# Altium schematic sheet UIO_INT.SchDoc: LiveDesign Evaluation - EvalBoard Tester
size A4; Organization: Altium Limited; Address1: L3, 12a Rodborough Rd; Address2: Frenchs Forest; Address3: NSW; Address4: Australia 2086; DocumentNumber: 8; SheetNumber: 8; SheetTotal: 16
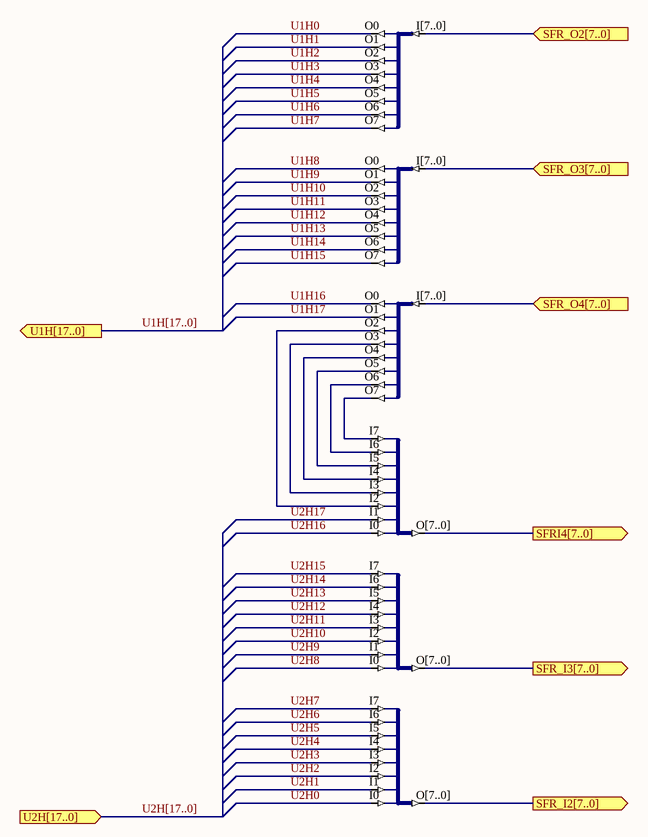
[diagram p0: UIO_INT.SchDoc]

## Parts
U198  J8B_8S  (value not drawn)
U199  J8B_8S  (value not drawn)
U200  J8B_8S  (value not drawn)
U201  J8S_8B  (value not drawn)
U202  J8S_8B  (value not drawn)
U203  J8S_8B  (value not drawn)

## Ports
SFR_I2[7..0] (out), SFR_I3[7..0] (out), SFR_O2[7..0] (in), SFR_O3[7..0] (in), SFR_O4[7..0] (in), SFRI4[7..0] (out), U1H[17..0] (out), U2H[17..0] (in)

## Nets
SFR_I2[7..0]: U203.O[7..0] ; port SFR_I2[7..0]
SFR_I3[7..0]: U202.O[7..0] ; port SFR_I3[7..0]
SFR_O2[7..0]: U198.I[7..0] ; port SFR_O2[7..0]
SFR_O3[7..0]: U199.I[7..0] ; port SFR_O3[7..0]
SFR_O4[7..0]: U200.I[7..0] ; port SFR_O4[7..0]
SFRI4[7..0]: U201.O[7..0] ; port SFRI4[7..0]
U1H0: U198.O0
U1H1: U198.O1
U1H2: U198.O2
U1H3: U198.O3
U1H4: U198.O4
U1H5: U198.O5
U1H6: U198.O6
U1H7: U198.O7
U1H8: U199.O0
U1H9: U199.O1
U1H10: U199.O2
U1H11: U199.O3
U1H12: U199.O4
U1H13: U199.O5
U1H14: U199.O6
U1H15: U199.O7
U1H16: U200.O0
U1H17: U200.O1
U2H0: U203.I0
U2H1: U203.I1
U2H2: U203.I2
U2H3: U203.I3
U2H4: U203.I4
U2H5: U203.I5
U2H6: U203.I6
U2H7: U203.I7
U2H8: U202.I0
U2H9: U202.I1
U2H10: U202.I2
U2H11: U202.I3
U2H12: U202.I4
U2H13: U202.I5
U2H14: U202.I6
U2H15: U202.I7
U2H16: U201.I0
U2H17: U201.I1
NetU200_O2: U200.O2 U201.I2
NetU200_O3: U200.O3 U201.I3
NetU200_O4: U200.O4 U201.I4
NetU200_O5: U200.O5 U201.I5
NetU200_O6: U200.O6 U201.I6
NetU200_O7: U200.O7 U201.I7

## Buses and harness runs
bus U1H[17..0] = port U1H[17..0]
bus U2H[17..0] = port U2H[17..0]

## Notes on the sheet
- Title
- Size:
- Date:
- A4
- Number:
- Time:
- Revision:
- Sheet
- of
- File:

## Library data of the parts
U198-U200 = J8B_8S: 8-Bit input bus to 8 single pin outputs; ArchiveName: GENERIC; VHDLIB_SIM: GENERIC_LIB; Published: 29-Jan-2004; Publisher: Altium Limited; Core Revision: 1.00.00
U201-U203 = J8S_8B: 8 Single pin inputs to single 8-Bit output bus; ArchiveName: GENERIC; VHDLIB_SIM: GENERIC_LIB; Published: 29-Jan-2004; Publisher: Altium Limited; Core Revision: 1.00.00